# EAGLE schematic lampuIOT (EAGLE 9.5.2)
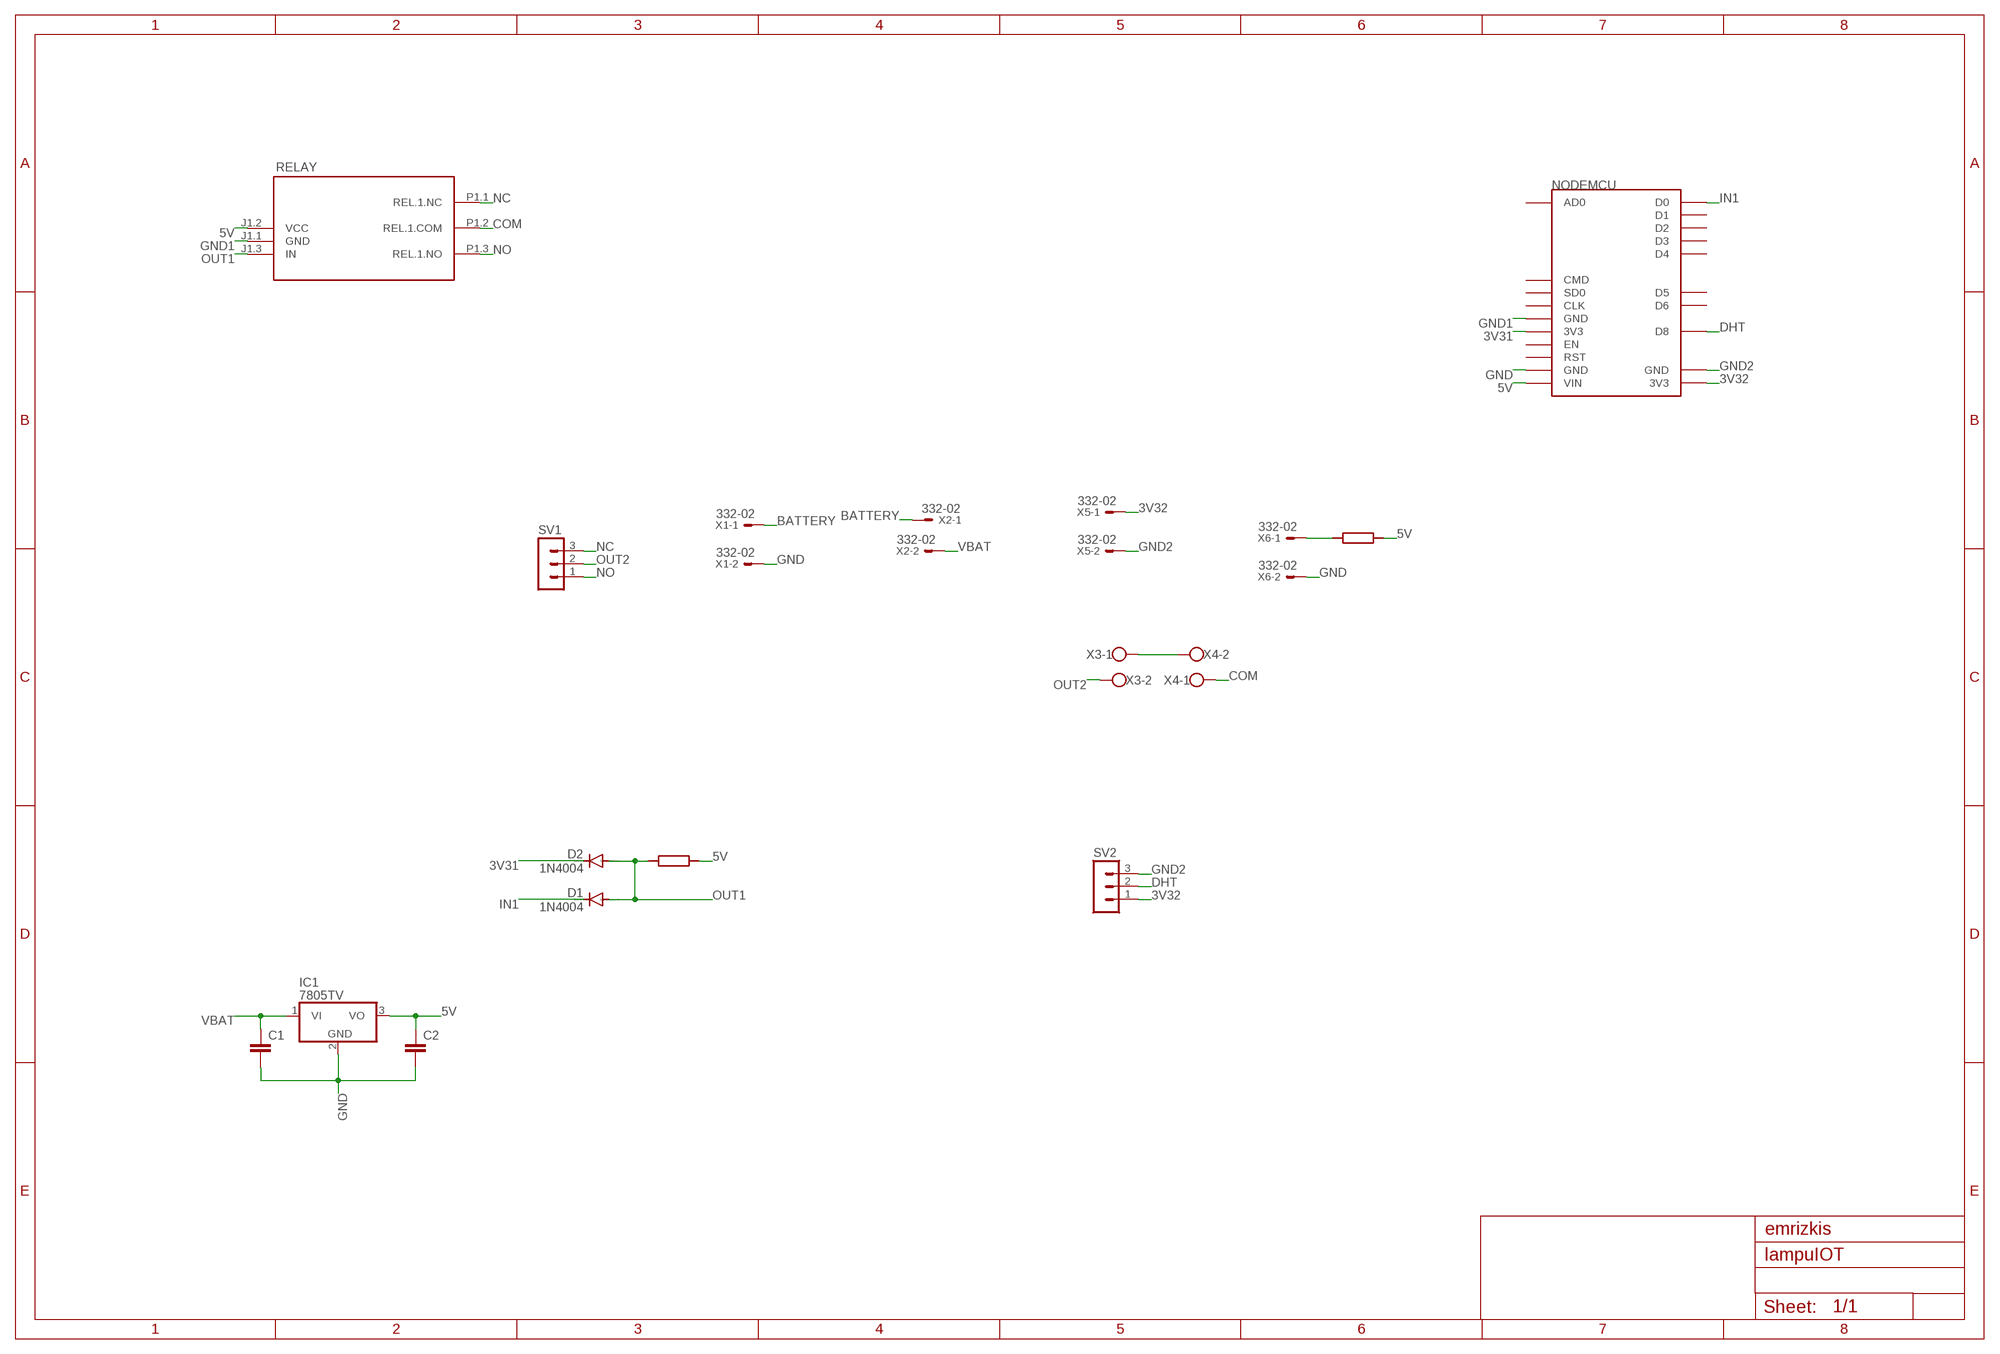
[diagram p0: schematic, sheet 1]

## Parts
C1  C2.5/2  [C2.5-2]
C2  C2.5/2  [C2.5-2]
D1  1N4004  [DO41-10]
D2  1N4004  [DO41-10]
IC1  7805TV  [TO220V]
NODEMCU  ESP12E_DEVKIT  [ESP12E_DEVKIT]
R  RESISTOR  [RESISTOR]
R1  RESISTOR  [RESISTOR]
RELAY  RELAY1CH  [RELAY1CH]
SV1  MA03-1  [MA03-1]
SV2  MA03-1  [MA03-1]
X1  332-02  [332-02]
X2  332-02  [332-02]
X3  W237-102  [W237-102]
X4  W237-102  [W237-102]
X5  332-02  [332-02]
X6  332-02  [332-02]

## Nets
3V31: D2.C NODEMCU.3V3@0(3V3)
3V32: NODEMCU.3V3@2(3V3) SV2.1 X5.1
5V: C2.1 IC1.3(VO) NODEMCU.VIN R1.P$1 R.P$1 RELAY.J1.2(VCC)
BATTERY: X1.1 X2.1
COM: RELAY.P1.2(REL.1.COM) X4.1
DHT: NODEMCU.D8 SV2.2
GND: C1.2 C2.2 IC1.2(GND) NODEMCU.GND@1(GND) X1.2 X6.2
GND1: NODEMCU.GND@0(GND) RELAY.J1.1(GND)
GND2: NODEMCU.GND@3(GND) SV2.3 X5.2
IN1: D1.C NODEMCU.D0
N$1: X3.1 X4.2
N$2: R1.P$2 X6.1
NC: RELAY.P1.1(REL.1.NC) SV1.3
NO: RELAY.P1.3(REL.1.NO) SV1.1
OUT1: D1.A D2.A R.P$2 RELAY.J1.3(IN)
OUT2: SV1.2 X3.2
VBAT: C1.1 IC1.1(VI) X2.2
Unconnected: NODEMCU.AD0 NODEMCU.CLK NODEMCU.CMD NODEMCU.D1 NODEMCU.D2 NODEMCU.D3 NODEMCU.D4 NODEMCU.D5 NODEMCU.D6 NODEMCU.EN NODEMCU.RST NODEMCU.SD0

## Notes on the sheet
- emrizkis

## Library data of the parts
C1 C2 = capacitor-wima:C: CAPACITOR naming: grid - package width
D1 D2 = diode:1N4004: DIODE general purpose rectifier, 1 A
IC1 = linear:78*: Positive VOLTAGE REGULATOR Source: http://cache.national.com/ds/LM/LM78L05.pdf http://www.fairchildsemi.com/ds/LM/LM7805.pdf
NODEMCU = node_lampuIOT:ESP12E_DEVKIT: ESP12E DEVKIT BOARD
R R1 = resistor:RESISTOR
RELAY = nodemcu_lolin:RELAY1CH
SV1 SV2 = con-lstb:MA03-1: PIN HEADER; OC_FARNELL: unknown; OC_NEWARK: unknown
X1 X2 X5 X6 = con-garry:332-02: 2 Pin - 2mm Dual Row Source: www.mpe-connector.de / garry_shortform_2012.pdf
X3 X4 = con-wago-500:W237-102: WAGO SCREW CLAMP; MPN: 237-102; OC_FARNELL: unknown; OC_NEWARK: 70K9898